# Altium schematic sheet PineapplePi-F1.SchDoc
size A3
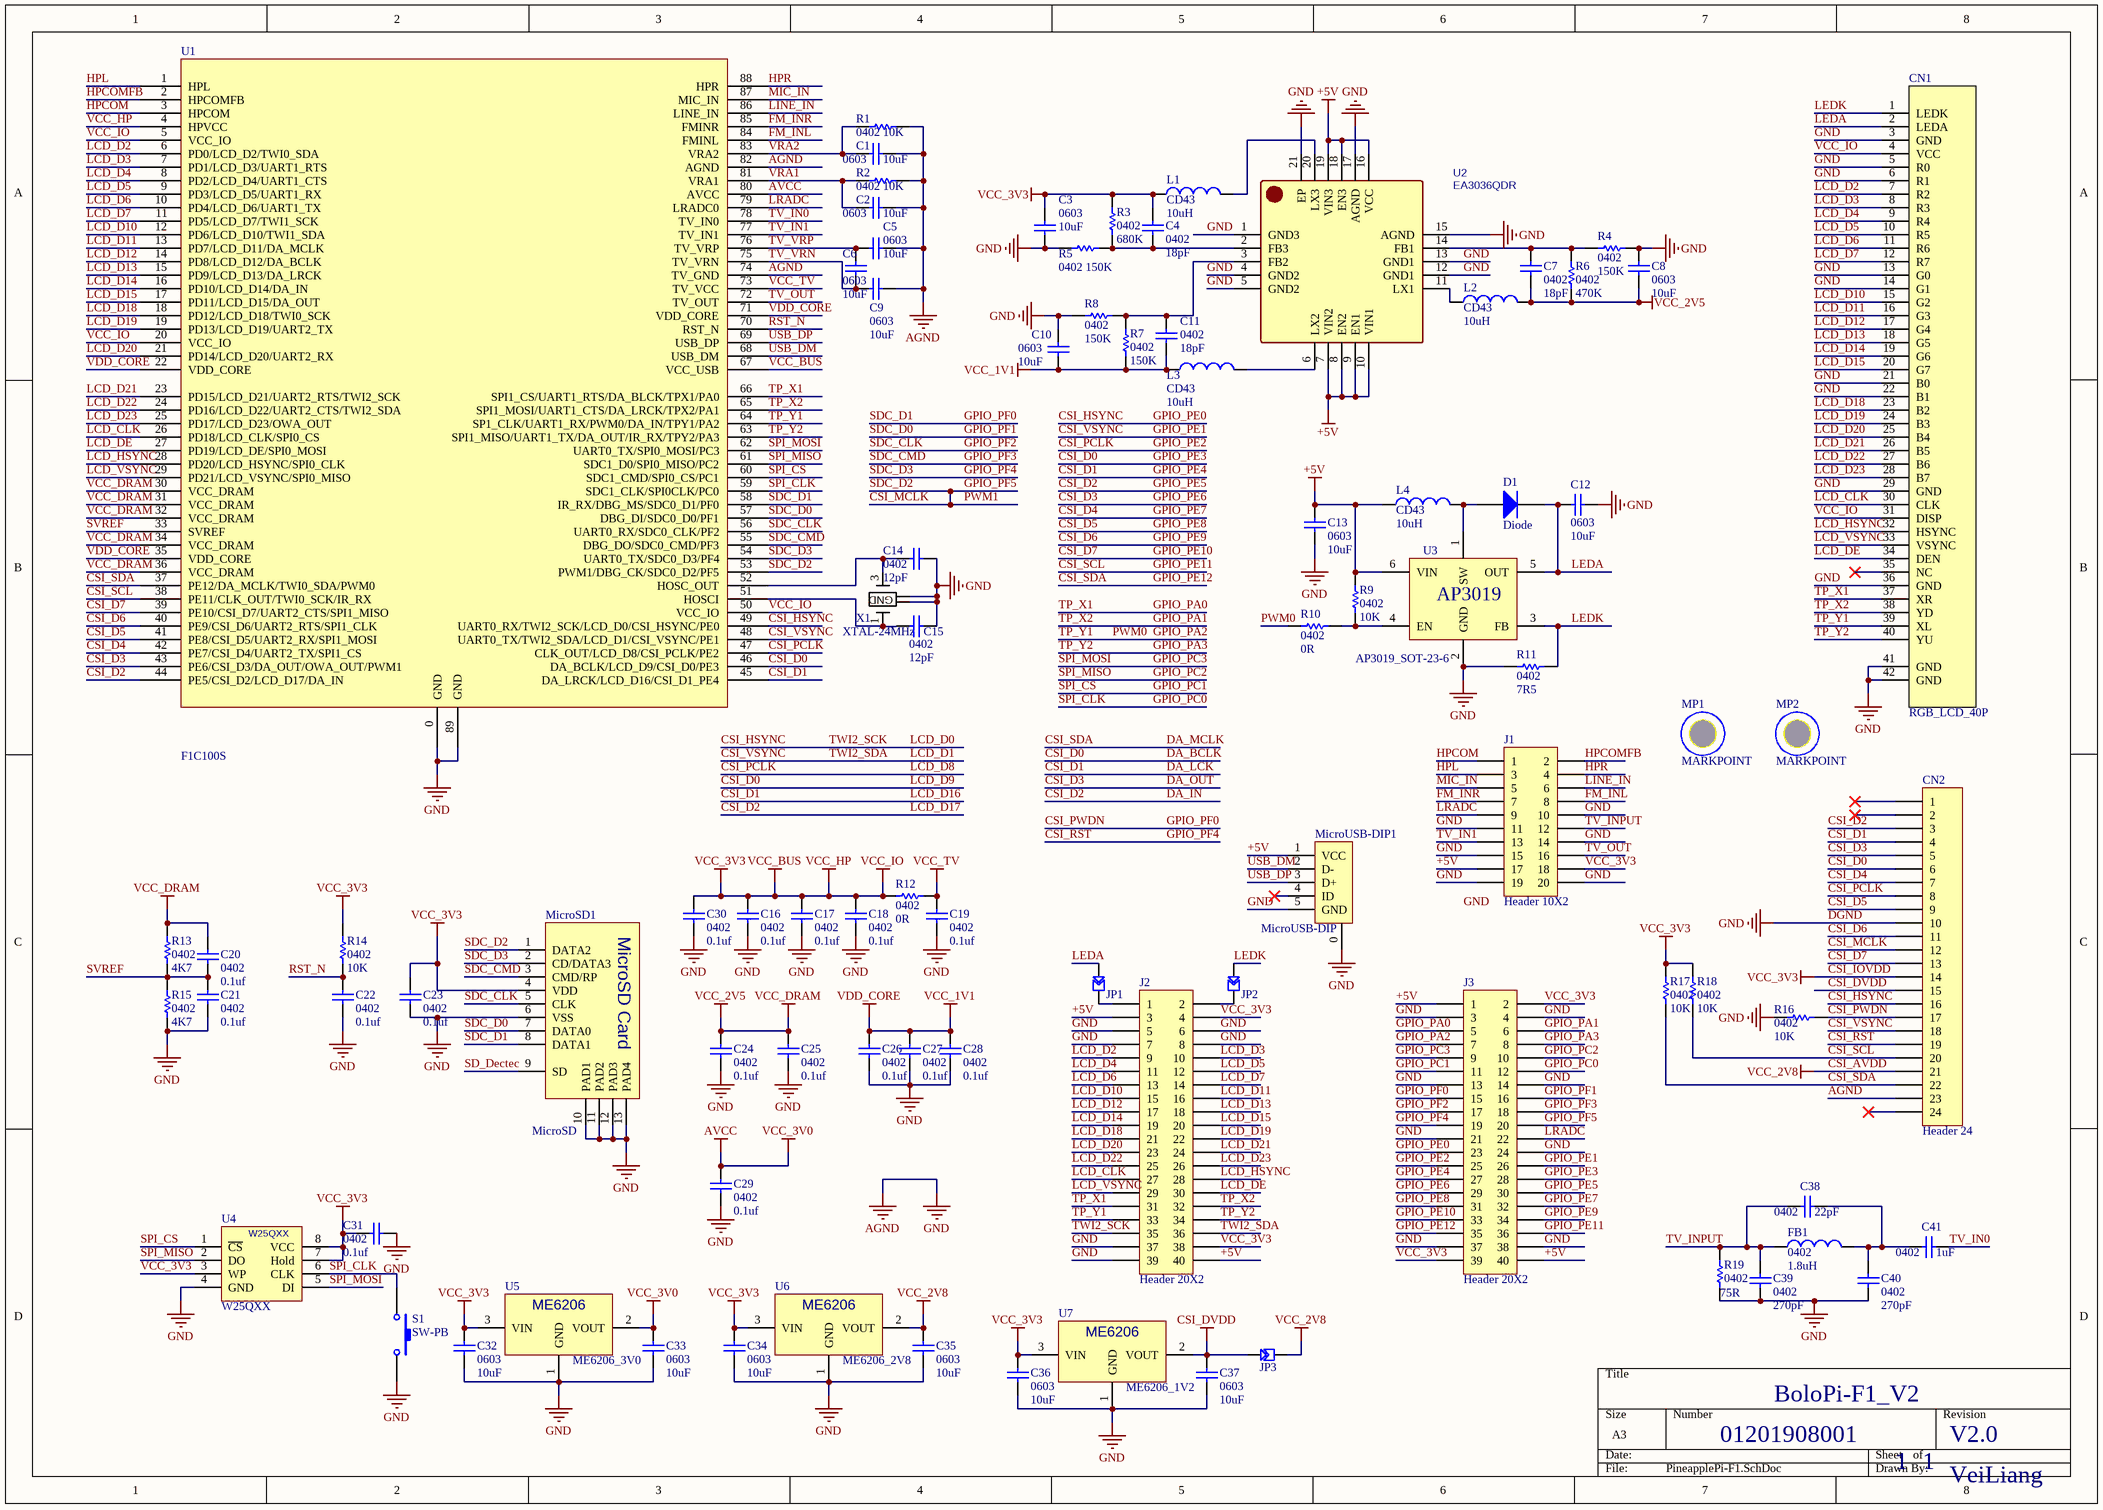
[diagram p0: PineapplePi-F1.SchDoc]

## Parts
C1  0603  value 10uF  [0603AC]
C2  0603  value 10uF  [0603AC]
C3  0603  value 10uF  [0603AC]
C4  0402  value 18pF  [0402AC]
C5  0603  value 10uF  [0603AC]
C6  0603  value 10uF  [0603AC]
C7  0402  value 18pF  [0402AC]
C8  0603  value 10uF  [0603AC]
C9  0603  value 10uF  [0603AC]
C10  0603  value 10uF  [0603AC]
C11  0402  value 18pF  [0402AC]
C12  0603  value 10uF  [0603AC]
C13  0603  value 10uF  [0603AC]
C14  0402  value 12pF  [0402AC]
C15  0402  value 12pF  [0402AC]
C16  0402  value 0.1uf  [0402AC]
C17  0402  value 0.1uf  [0402AC]
C18  0402  value 0.1uf  [0402AC]
C19  0402  value 0.1uf  [0402AC]
C20  0402  value 0.1uf  [0402AC]
C21  0402  value 0.1uf  [0402AC]
C22  0402  value 0.1uf  [0402AC]
C23  0402  value 0.1uf  [0402AC]
C24  0402  value 0.1uf  [0402AC]
C25  0402  value 0.1uf  [0402AC]
C26  0402  value 0.1uf  [0402AC]
C27  0402  value 0.1uf  [0402AC]
C28  0402  value 0.1uf  [0402AC]
C29  0402  value 0.1uf  [0402AC]
C30  0402  value 0.1uf  [0402AC]
C31  0402  value 0.1uf  [0402AC]
C32  0603  value 10uF  [0603AC]
C33  0603  value 10uF  [0603AC]
C34  0603  value 10uF  [0603AC]
C35  0603  value 10uF  [0603AC]
C36  0603  value 10uF  [0603AC]
C37  0603  value 10uF  [0603AC]
C38  0402  value 22pF  [0402AC]
C39  0402  value 270pF  [0402AC]
C40  0402  value 270pF  [0402AC]
C41  0402  value 1uF  [0402AC]
CN1  RGB_LCD_40P  [FH19C-40S-0.5SH]
CN2  Header 24  [FH19C-24S-0.5SH]
D1  Diode  [SOD123]
FB1  0402  value 1.8uH  [0402AR]
J1  Header 10X2  [HDR2X10-2.0mm]
J2  Header 20X2  [HDR2X20]
J3  Header 20X2  [HDR2X20]
JP1  SW-PAD-2  [SW-PAD-2]  (value not drawn)
JP2  SW-PAD-2  [SW-PAD-2]  (value not drawn)
JP3  SW-PAD-2  [SW-PAD-2]  (value not drawn)
L1  CD43  value 10uH  [2520]
L2  CD43  value 10uH  [2520]
L3  CD43  value 10uH  [2520]
L4  CD43  value 10uH  [2520]
MicroSD1  MicroSD  [MicroSD]
MicroUSB-DIP1  MicroUSB-DIP  [MICRO_USB_DIP]
MP1  MARKPOINT  [MARKPOINT]
MP2  MARKPOINT  [MARKPOINT]
R1  0402  value 10K  [0402AR]
R2  0402  value 10K  [0402AR]
R3  0402  value 680K  [0402AR]
R4  0402  value 150K  [0402AR]
R5  0402  value 150K  [0402AR]
R6  0402  value 470K  [0402AR]
R7  0402  value 150K  [0402AR]
R8  0402  value 150K  [0402AR]
R9  0402  value 10K  [0402AR]
R10  0402  value 0R  [0402AR]
R11  0402  value 7R5  [0402AR]
R12  0402  value 0R  [0402AR]
R13  0402  value 4K7  [0402AR]
R14  0402  value 10K  [0402AR]
R15  0402  value 4K7  [0402AR]
R16  0402  value 10K  [0402AR]
R17  0402  value 10K  [0402AR]
R18  0402  value 10K  [0402AR]
R19  0402  value 75R  [0402AR]
S1  SW-PB  [SW-SMD1]
U1  F1C100S  [QFN88-10X10]
U2  EA3036QDR  [QFN20-3x3-0.4]
U3  AP3019_SOT-23-6  [SOT23-6]
U4  W25QXX  [SO-8M]
U5  ME6206_3V0  [SOT-23]
U6  ME6206_2V8  [SOT-23]
U7  ME6206_1V2  [SOT-23]
X1  XTAL-24MHz  [XTAL-3225]

## Nets
+5V: C13.2 J1.17 J2.3 J2.40 J3.1 J3.40 L4.1 MicroUSB-DIP1.1(VCC) R9.1 U2.7(VIN2) U2.8(EN2) U2.9(EN1) U2.10(VIN1) U2.16(VCC) U2.18(EN3) U2.19(VIN3) U3.6(VIN)
AGND: C1.2 C2.2 C3.2 C5.2 C8.2 C9.2 C10.1 C12.2 C13.1 C14.1 C15.1 C16.1 C17.1 C18.1 C19.1 C21.1 C22.1 C23.1 C24.1 C25.1 C26.1 C27.1 C28.1 C29.1 C30.2 C31.1 C32.1 C33.1 C34.1 C35.1 C36.1 C37.1 C39.2 C40.2 CN1.3(GND) CN1.5(R0) CN1.6(R1) CN1.13(G0) CN1.14(G1) CN1.21(B0) CN1.22(B1) CN1.29(GND) CN1.36(GND) CN1.41(GND) CN1.42(GND) CN2.10 CN2.23 J1.10 J1.11 J1.14 J1.15 J1.19 J1.20 J2.5 J2.6 J2.7 J2.8 J2.37 J2.39 J3.3 J3.4 J3.13 J3.14 J3.21 J3.24 J3.37 J3.38 MicroSD1.6(VSS) MicroSD1.10(PAD1) MicroSD1.11(PAD2) MicroSD1.12(PAD3) MicroSD1.13(PAD4) MicroUSB-DIP1.0 MicroUSB-DIP1.5(GND) R1.1 R2.1 R4.2 R5.2 R8.2 R11.1 R15.1 R16.1 R19.1 S1.2 U1.0(GND) U1.74(TV_GND) U1.82(AGND) U1.89(GND) U2.1(GND3) U2.4(GND2) U2.5(GND2) U2.12(GND1) U2.13(GND1) U2.15(AGND) U2.17(AGND) U2.21(EP) U3.2(GND) U4.4(GND) U5.1(GND) U6.1(GND) U7.1(GND) X1.2 X1.4  [also labelled DGND, GND]
AVCC: C29.2 C33.2 U1.80(AVCC) U5.2(VOUT)  [also labelled VCC_3V0]
CSI_AVDD: C35.2 CN2.21 JP3.2 U6.2(VOUT)  [also labelled VCC_2V8]
CSI_DVDD: C37.2 CN2.15 JP3.1 U7.2(VOUT)
CSI_IOVDD: C3.1 C4.1 C16.2 C17.2 C18.2 C23.2 C30.1 C31.2 C32.2 C34.2 C36.2 CN1.4(VCC) CN1.31(DISP) CN2.14 J1.18 J2.4 J2.38 J3.2 J3.39 L1.1 MicroSD1.4(VDD) R3.2 R12.2 R14.2 R17.2 R18.2 U1.4(HPVCC) U1.5(VCC_IO) U1.20(VCC_IO) U1.50(VCC_IO) U1.67(VCC_USB) U4.3(WP) U4.7(Hold) U4.8(VCC) U5.3(VIN) U6.3(VIN) U7.3(VIN)  [also labelled VCC_3V3, VCC_BUS, VCC_HP, VCC_IO]
VCC_DRAM: C7.1 C8.1 C20.2 C24.2 C25.2 L2.2 R6.2 R13.2 U1.30(VCC_DRAM) U1.31(VCC_DRAM) U1.32(VCC_DRAM) U1.34(VCC_DRAM) U1.36(VCC_DRAM)  [also labelled VCC_2V5]
VCC_TV: C19.2 R12.1 U1.73(TV_VCC)
VDD_CORE: C10.2 C11.1 C26.2 C27.2 C28.2 L3.1 R7.1 U1.22(VDD_CORE) U1.35(VDD_CORE) U1.71(VDD_CORE)  [also labelled VCC_1V1]
CSI_D0: CN2.6 J3.28 U1.46(DA_BCLK/LCD_D9/CSI_D0/PE3)  [also labelled DA_BCLK, GPIO_PE3, LCD_D9]
CSI_D1: CN2.4 J3.27 U1.45(DA_LRCK/LCD_D16/CSI_D1_PE4)  [also labelled DA_LCK, GPIO_PE4, LCD_D16]
CSI_D2: CN2.3 J3.30 U1.44(PE5/CSI_D2/LCD_D17/DA_IN)  [also labelled DA_IN, GPIO_PE5, LCD_D17]
CSI_D3: CN2.5 J3.29 U1.43(PE6/CSI_D3/DA_OUT/OWA_OUT/PWM1)  [also labelled DA_OUT, GPIO_PE6]
CSI_D4: CN2.7 J3.32 U1.42(PE7/CSI_D4/UART2_TX/SPI1_CS)  [also labelled GPIO_PE7]
CSI_D5: CN2.9 J3.31 U1.41(PE8/CSI_D5/UART2_RX/SPI1_MOSI)  [also labelled GPIO_PE8]
CSI_D6: CN2.11 J3.34 U1.40(PE9/CSI_D6/UART2_RTS/SPI1_CLK)  [also labelled GPIO_PE9]
CSI_D7: CN2.13 J3.33 U1.39(PE10/CSI_D7/UART2_CTS/SPI1_MISO)  [also labelled GPIO_PE10]
CSI_HSYNC: CN2.16 J2.35 J3.23 U1.49(UART0_RX/TWI2_SCK/LCD_D0/CSI_HSYNC/PE0)  [also labelled GPIO_PE0, LCD_D0, TWI2_SCK]
CSI_MCLK: CN2.12 J3.20 MicroSD1.1(DATA2) U1.53(PWM1/DBG_CK/SDC0_D2/PF5)  [also labelled GPIO_PF5, PWM1, SDC_D2]
CSI_PCLK: CN2.8 J3.25 U1.47(CLK_OUT/LCD_D8/CSI_PCLK/PE2)  [also labelled GPIO_PE2, LCD_D8]
CSI_PWDN: CN2.17 J3.15 MicroSD1.8(DATA1) R16.2 U1.58(IR_RX/DBG_MS/SDC0_D1/PF0)  [also labelled GPIO_PF0, SDC_D1]
CSI_RST: CN2.19 J3.19 MicroSD1.2(CD/DATA3) U1.54(UART0_TX/SDC0_D3/PF4)  [also labelled GPIO_PF4, SDC_D3]
CSI_SCL: CN2.20 J3.36 R18.1 U1.38(PE11/CLK_OUT/TWI0_SCK/IR_RX)  [also labelled GPIO_PE11]
CSI_SDA: CN2.22 J3.35 R17.1 U1.37(PE12/DA_MCLK/TWI0_SDA/PWM0)  [also labelled DA_MCLK, GPIO_PE12]
CSI_VSYNC: CN2.18 J2.36 J3.26 U1.48(UART0_TX/TWI2_SDA/LCD_D1/CSI_VSYNC/PE1)  [also labelled GPIO_PE1, LCD_D1, TWI2_SDA]
FM_INL: J1.8 U1.84(FMINL)
FM_INR: J1.7 U1.85(FMINR)
GPIO_PA0: CN1.37(XR) J2.31 J3.5 U1.66(SPI1_CS/UART1_RTS/DA_BLCK/TPX1/PA0)  [also labelled TP_X1]
GPIO_PA1: CN1.38(YD) J2.32 J3.6 U1.65(SPI1_MOSI/UART1_CTS/DA_LRCK/TPX2/PA1)  [also labelled TP_X2]
GPIO_PA2: CN1.39(XL) J2.33 J3.7 R10.1 U1.64(SP1_CLK/UART1_RX/PWM0/DA_IN/TPY1/PA2)  [also labelled PWM0, TP_Y1]
GPIO_PA3: CN1.40(YU) J2.34 J3.8 U1.63(SPI1_MISO/UART1_TX/DA_OUT/IR_RX/TPY2/PA3)  [also labelled TP_Y2]
GPIO_PC0: J3.12 S1.1 U1.59(SDC1_CLK/SPI0CLK/PC0) U4.6(CLK)  [also labelled SPI_CLK]
GPIO_PC1: J3.11 U1.60(SDC1_CMD/SPI0_CS/PC1) U4.1(~{CS})  [also labelled SPI_CS]
GPIO_PC2: J3.10 U1.61(SDC1_D0/SPI0_MISO/PC2) U4.2(DO)  [also labelled SPI_MISO]
GPIO_PC3: J3.9 U1.62(UART0_TX/SPI0_MOSI/PC3) U4.5(DI)  [also labelled SPI_MOSI]
GPIO_PF1: J3.16 MicroSD1.7(DATA0) U1.57(DBG_DI/SDC0_D0/PF1)  [also labelled SDC_D0]
GPIO_PF2: J3.17 MicroSD1.5(CLK) U1.56(UART0_RX/SDC0_CLK/PF2)  [also labelled SDC_CLK]
GPIO_PF3: J3.18 MicroSD1.3(CMD/RP) U1.55(DBG_DO/SDC0_CMD/PF3)  [also labelled SDC_CMD]
HPCOM: J1.1 U1.3(HPCOM)
HPCOMFB: J1.2 U1.2(HPCOMFB)
HPL: J1.3 U1.1(HPL)
HPR: J1.4 U1.88(HPR)
LCD_CLK: CN1.30(CLK) J2.27 U1.26(PD18/LCD_CLK/SPI0_CS)
LCD_D2: CN1.7(R2) J2.9 U1.6(PD0/LCD_D2/TWI0_SDA)
LCD_D3: CN1.8(R3) J2.10 U1.7(PD1/LCD_D3/UART1_RTS)
LCD_D4: CN1.9(R4) J2.11 U1.8(PD2/LCD_D4/UART1_CTS)
LCD_D5: CN1.10(R5) J2.12 U1.9(PD3/LCD_D5/UART1_RX)
LCD_D6: CN1.11(R6) J2.13 U1.10(PD4/LCD_D6/UART1_TX)
LCD_D7: CN1.12(R7) J2.14 U1.11(PD5/LCD_D7/TWI1_SCK)
LCD_D10: CN1.15(G2) J2.15 U1.12(PD6/LCD_D10/TWI1_SDA)
LCD_D11: CN1.16(G3) J2.16 U1.13(PD7/LCD_D11/DA_MCLK)
LCD_D12: CN1.17(G4) J2.17 U1.14(PD8/LCD_D12/DA_BCLK)
LCD_D13: CN1.18(G5) J2.18 U1.15(PD9/LCD_D13/DA_LRCK)
LCD_D14: CN1.19(G6) J2.19 U1.16(PD10/LCD_D14/DA_IN)
LCD_D15: CN1.20(G7) J2.20 U1.17(PD11/LCD_D15/DA_OUT)
LCD_D18: CN1.23(B2) J2.21 U1.18(PD12/LCD_D18/TWI0_SCK)
LCD_D19: CN1.24(B3) J2.22 U1.19(PD13/LCD_D19/UART2_TX)
LCD_D20: CN1.25(B4) J2.23 U1.21(PD14/LCD_D20/UART2_RX)
LCD_D21: CN1.26(B5) J2.24 U1.23(PD15/LCD_D21/UART2_RTS/TWI2_SCK)
LCD_D22: CN1.27(B6) J2.25 U1.24(PD16/LCD_D22/UART2_CTS/TWI2_SDA)
LCD_D23: CN1.28(B7) J2.26 U1.25(PD17/LCD_D23/OWA_OUT)
LCD_DE: CN1.34(DEN) J2.30 U1.27(PD19/LCD_DE/SPI0_MOSI)
LCD_HSYNC: CN1.32(HSYNC) J2.28 U1.28(PD20/LCD_HSYNC/SPI0_CLK)
LCD_VSYNC: CN1.33(VSYNC) J2.29 U1.29(PD21/LCD_VSYNC/SPI0_MISO)
LEDA: C12.1 CN1.2(LEDA) D1.2(K) JP1.1 U3.5(OUT)
LEDK: CN1.1(LEDK) JP2.1 R11.2 U3.3(FB)
LINE_IN: J1.6 U1.86(LINE_IN)
LRADC: J1.9 J3.22 U1.79(LRADC0)
MIC_IN: J1.5 U1.87(MIC_IN)
RST_N: C22.2 R14.1 U1.70(RST_N)
SD_Dectec: MicroSD1.9(SD)
SVREF: C20.1 C21.2 R13.1 R15.2 U1.33(SVREF)
TV_IN0: C41.1 U1.78(TV_IN0)
TV_IN1: J1.13 U1.77(TV_IN1)
TV_INPUT: C38.2 C39.1 FB1.1 J1.12 R19.2
TV_OUT: J1.16 U1.72(TV_OUT)
TV_VRN: C6.1 C9.1 U1.75(TV_VRN)
TV_VRP: C5.1 C6.2 U1.76(TV_VRP)
USB_DM: MicroUSB-DIP1.2(D-) U1.68(USB_DM)
USB_DP: MicroUSB-DIP1.3(D+) U1.69(USB_DP)
VRA1: C2.1 R2.2 U1.81(VRA1)
VRA2: C1.1 R1.2 U1.83(VRA2)
NetC4_2: C4.2 R3.1 R5.1 U2.2(FB3)
NetC7_2: C7.2 R4.1 R6.1 U2.14(FB1)
NetC11_2: C11.2 R7.2 R8.1 U2.3(FB2)
NetC14_2: C14.2 U1.52(HOSC_OUT) X1.3(GND)
NetC15_2: C15.2 U1.51(HOSCI) X1.1
NetC38_1: C38.1 C40.1 C41.2 FB1.2
NetD1_1: D1.1(A) L4.2 U3.1(SW)
NetJ2_1: J2.1 JP1.2
NetJ2_2: J2.2 JP2.2
NetL1_2: L1.2 U2.20(LX3)
NetL2_1: L2.1 U2.11(LX1)
NetL3_2: L3.2 U2.6(LX2)
NetR9_2: R9.2 R10.2 U3.4(EN)

Not connected (* = marked no-connect by the designer): CN1 35(NC)*; CN2 1* 2* 24*; MicroUSB-DIP1 4(ID)*

## Notes on the sheet
- 01201908001
- BoloPi-F1_V2
- V2.0
- 1
- VeiLiang
- Labels drawn without touching a wire or pin: GND
- (in symbol MicroSD) MicroSD Card

## Library data of the parts
C1-C41 = Cap: Capacitor; Published: 8-Jun-2000; LatestRevisionDate: 17-Jul-2002; LatestRevisionNote: Re-released for DXP Platform.; PackageReference: RAD-0.3; Publisher: Altium Limited
CN2 = Header 24: Header, 24-Pin; LatestRevisionDate: 17-Jul-2002; LatestRevisionNote: Re-released for DXP Platform.; Publisher: Altium Limited
D1 = Diode: Default Diode; Published: 8-Jun-2000; LatestRevisionDate: 17-Jul-2002; LatestRevisionNote: Re-released for DXP Platform.; PackageVersion: Sep-1996; PackageReference: SMC; Publisher: Altium Limited; Code_JEDEC: DO-214-AB
FB1 = Inductor: CD43; Code_IEC: 1005; Published: 8-Jun-2000; LatestRevisionDate: 29-May-2009; LatestRevisionNote: IPC-7351 Footprint Added.; PackageReference: 0402-A; Publisher: Altium Limited; PackageDescription: Chip Inductor; Code_JEITA: 0402
J1 = Header 10X2: Header, 10-Pin, Dual row; LatestRevisionDate: 17-Jul-2002; LatestRevisionNote: Re-released for DXP Platform.; Publisher: Altium Limited
J2 J3 = Header 20X2: Header, 20-Pin, Dual row; LatestRevisionDate: 17-Jul-2002; LatestRevisionNote: Re-released for DXP Platform.; Publisher: Altium Limited
L1-L4 = Inductor: Code_IEC: 1005; Published: 8-Jun-2000; LatestRevisionDate: 29-May-2009; LatestRevisionNote: IPC-7351 Footprint Added.; PackageReference: 0402-A; Publisher: Altium Limited; PackageDescription: Chip Inductor; Code_JEITA: 0402
R1 R2 R4 R5 R19 = Res1: Resistor; Published: 8-Jun-2000; LatestRevisionDate: 17-Jul-2002; LatestRevisionNote: Re-released for DXP Platform.; PackageReference: AXIAL-0.3; Publisher: Altium Limited
R3 R6-R18 = Res1: Published: 8-Jun-2000; LatestRevisionDate: 17-Jul-2002; LatestRevisionNote: Re-released for DXP Platform.; PackageReference: AXIAL-0.3; Publisher: Altium Limited
S1 = SW-PB: Switch; Published: 24-Mar-1999; LatestRevisionDate: 17-Jul-2002; LatestRevisionNote: Re-released for DXP Platform.; PackageReference: SPST-2; Publisher: Altium Limited
U2 = EA3036QDR: BOM_Manufacturer: Everanalog; spicePre: X; BOM_Manufacturer Part: EA3036QDR; BOM_Supplier: LCSC; BOM_Supplier Part: C111587
U3 = AP3019
U5-U7 = ME6206
X1 = XTAL-SMD